# Altium schematic sheet Diagnostics.SchDoc: AI ARTIQ Driver
size 420 x 297 mm; Author: G.Kasprowicz; CompanyName: CTI; Organization: CTI; Address1: CTI; Address2: Nowowiejska 15/19 00-665 Warsaw; Address3: gkasprow@gmail.com; DocumentNumber: 6; Revision: 1.0; SheetNumber: 6; SheetTotal: 11; ModifiedBy: -; CheckedDate: -; Title2: protection; DivGrp: CTI; ModifiedDate: -; ProjectName: Sensor Box
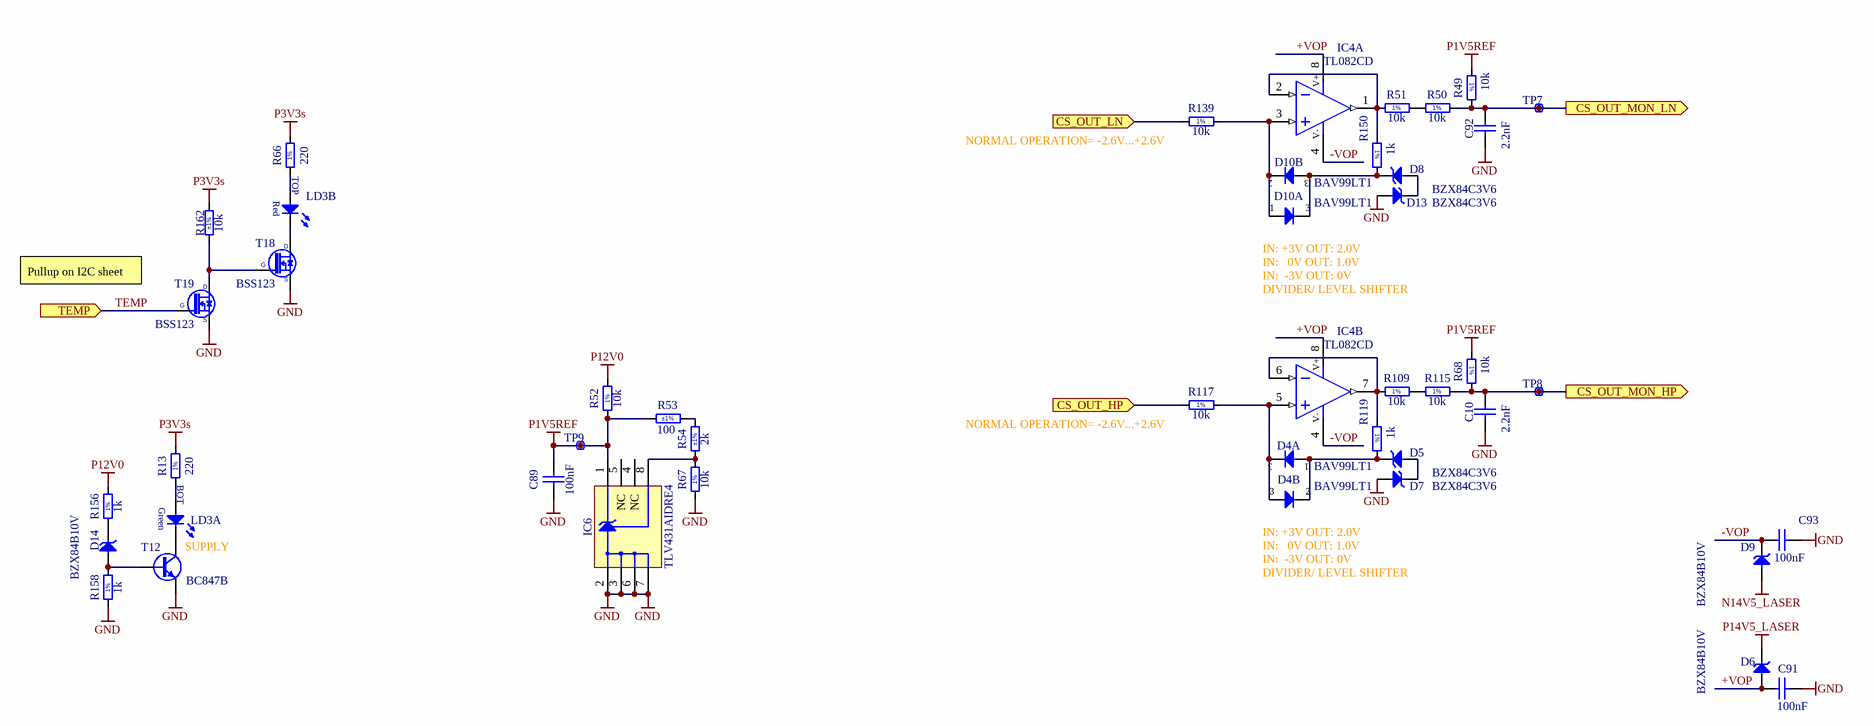
[diagram p0: Diagnostics.SchDoc]

## Parts
C10  2.2nF  [CAPC1608X87N]
C89  100nF  [CAPC1608X87N]
C91  100nF  [CAPC1608X87N]
C92  2.2nF  [CAPC1608X87N]
C93  100nF  [CAPC1608X87N]
D4  BAV99LT1  [SOT95P240X110-3N]  (parts A,B of 2)
D5  BZX84C3V6  [SOT95P240X130-3N]
D6  BZX84B10V  [SOT95P248X115-3N]
D7  BZX84C3V6  [SOT95P240X130-3N]
D8  BZX84C3V6  [SOT95P240X130-3N]
D9  BZX84B10V  [SOT95P248X115-3N]
D10  BAV99LT1  [SOT95P240X110-3N]  (parts A,B of 2)
D13  BZX84C3V6  [SOT95P240X130-3N]
D14  BZX84B10V  [SOT95P248X115-3N]
IC4  TL082CD  [SOIC127P600X175-8N]  (parts A,B of 2)
IC6  TLV431AIDRE4  [SOIC127P600X175-8N]
LD3  Red/Green  [LED_DIALIGHT_571-0112F]  (value not drawn)  (parts A,B of 2)
R13  220  [RESC1608X55N]
R49  10k  [RESC1608X55N]
R50  10k  [RESC1608X55N]
R51  10k  [RESC1608X55N]
R52  10k  [RESC1608X55N]
R53  100  Tolerance: ±1%  [RESC1608X55N]
R54  2k  Tolerance: ±1%  [RESC1608X55N]
R66  220  [RESC1608X55N]
R67  10k  [RESC1608X55N]
R68  10k  [RESC1608X55N]
R109  10k  [RESC1608X55N]
R115  10k  [RESC1608X55N]
R117  10k  [RESC1608X55N]
R119  1k  [RESC1608X55N]
R139  10k  [RESC1608X55N]
R150  1k  [RESC1608X55N]
R156  1k  [RESC1608X55N]
R158  1k  [RESC1608X55N]
R162  10k  Tolerance: ±1%  [RESC1005X40N]
T12  BC847B  [SOT95P230X110-3N]
T18  BSS123  [SOT95P240X130-3N]
T19  BSS123  [SOT95P240X130-3N]
TP7  Test Point  [TPS127]  (value not drawn)  (no BOM)
TP8  Test Point  [TPS127]  (value not drawn)  (no BOM)
TP9  Test Point  [TPS127]  (value not drawn)  (no BOM)

## Ports
CS_OUT_HP (in), CS_OUT_LN (in), CS_OUT_MON_HP (out), CS_OUT_MON_LN (out), TEMP (in)

## Nets
GND: C10.1 C89.1 C91.2 C92.1 C93.2 D7.1(A) D13.1(A) IC6.2(A) IC6.3(A) IC6.6(A) IC6.7(A) R67.1 R158.1 T12.2(E) T18.2(S) T19.2(S)
N14V5_LASER: D9.1(A)
P1V5REF: C89.2 IC6.1(C) R49.1 R52.1 R53.2 R68.1 TP9.1
P3V3s: R13.2 R66.2 R162.2
P12V0: R52.2 R156.2
P14V5_LASER: D6.3(C)
+VOP: C91.1 D6.1(A) IC4.8(V+)
-VOP: C93.1 D9.3(C) IC4.4(V-)
CS_OUT_HP: R117.1 ; port CS_OUT_HP
CS_OUT_LN: R139.1 ; port CS_OUT_LN
CS_OUT_MON_HP: C10.2 R68.2 R115.2 TP8.1 ; port CS_OUT_MON_HP
CS_OUT_MON_LN: C92.2 R49.2 R50.2 TP7.1 ; port CS_OUT_MON_LN
TEMP: T19.1(G) ; port TEMP
NetD4_1: D4.1(A) D4.2(C) D5.3(C) R119.2
NetD4_3: D4.3(COMAC) IC4.5(IN+) R117.2
NetD5_1: D5.1(A) D7.3(C)
NetD8_1: D8.1(A) D13.3(C)
NetD8_3: D8.3(C) D10.3(COMAC) R150.2
NetD10_1: D10.1(A) D10.2(C) IC4.3(IN+) R139.2
NetD14_1: D14.1(A) R158.2 T12.1(B)
NetD14_3: D14.3(C) R156.1
NetIC4_1: IC4.1(OUT) IC4.2(IN-) R51.1 R150.1
NetIC4_6: IC4.6(IN-) IC4.7(OUT) R109.1 R119.1
NetIC6_8: IC6.8(REF) R54.1 R67.2
NetLD3_1: LD3.1(C) T12.3(C)
NetLD3_2: LD3.2(A) R13.1
NetLD3_3: LD3.3(C) T18.3(D)
NetLD3_4: LD3.4(A) R66.1
NetR50_1: R50.1 R51.2
NetR53_1: R53.1 R54.2
NetR109_2: R109.2 R115.1
NetR162_1: R162.1 T18.1(G) T19.3(D)

Not connected (* = marked no-connect by the designer): IC6 4(NC) 5(NC)

## Notes on the sheet
- (near R139) NORMAL OPERATION= -2.6V...+2.6V
- Pullup on I2C sheet
- IN:  -3V OUT: 0V
- (near D10) IN: +3V OUT: 2.0V
- IN:   0V OUT: 1.0V
- DIVIDER/ LEVEL SHIFTER
- (near R117) NORMAL OPERATION= -2.6V...+2.6V
- SUPPLY
- (near D4) IN: +3V OUT: 2.0V
- Project/Equipment
- Document
- Designer
- Drawn by
- Check.by
- Copyright 2018.
  This documentation describes Open Hardware and is licensed under the CERN OHL v.1.1. You may redistribute and modify this documentation under the terms of the CERN OHL v.1.1. (http://ohwr.org/CERNOHL). This documentation is distributed WITHOUT ANY EXPRESS OR IMPLIED WARRANTY, INCLUDING OF MERCHANTABILITY, SATISFACTORY QUALITY AND FITNESS FOR A PARTICULAR PURPOSE. Please see the CERN OHL v.1.1 for applicable conditions.
- Contact
- File
- Last Mod.
- Print Date
- Sheet
- Size
- A3
- of
- Rev
- (in symbol LED_DIALIGHT_571-0112F, part A) BOT; Green
- (in symbol LED_DIALIGHT_571-0112F, part B) TOP; Red
- (in symbol R0603_1K_1%_0.1W_100PPM) 1%
- (in symbol R0603_10K_1%_0.1W_100PPM) 1%
- (in symbol R0603_220R_1%_0.1W_100PPM) 1%

## Library data of the parts
C10 C92 = CC0603_2.2NF_50V_5%_C0G: Non-polarised capacitor; Part Description: SMD Multilayer Chip Ceramic Capacitor; Manufacturer: GENERIC; Manufacturer1 Part Number: C1608C0G1H222J080AA; Voltage: 50V; TC: C0G/NP0; Tolerance: ±5%; Part Number: CC0603_2.2NF_50V_5%_C0G; Component Kind: Standard; Component Type: Standard; Pin Count: 2; Value: 2.2nF; Status: Preferred; Manufacturer Part Number: CC0603_2.2NF_50V_5%_C0G; Case: 0603; Mounted: Yes; Socket: No; SMD: Yes; Sense: No; Manufacturer1 Example: TDK; Manufacturer1 ComponentHeight: 0.9mm; HelpURL: \\cern.ch\dfs\Applications\Altium\Datasheets\CC0603_C0G_TDK_C.pdf; Author: CERN DEM JMW; CreateDate: 23.06.2014; LatestRevisionDate: 23.06.2014
C89 C91 C93 = CC0603_100NF_50V_10%_X7R: Non-polarised capacitor; Part Description: SMD Multilayer Chip Ceramic Capacitor; Manufacturer: GENERIC; Manufacturer1 Part Number: 223858615649; Voltage: 50V; TC: X7R; Tolerance: ±10%; Part Number: CC0603_100NF_50V_10%_X7R; Component Kind: Standard; Component Type: Standard; Pin Count: 2; Value: 100nF; Status: Preferred; Manufacturer Part Number: CC0603_100NF_50V_10%_X7R; Case: 0603; Mounted: Yes; Socket: No; SMD: Yes; Sense: No; Manufacturer1 Example: PHYCOMP; Manufacturer1 ComponentHeight: 0.87mm; HelpURL: \\cern.ch\dfs\Applications\Altium\Datasheets\CC0603_X7R_PHYCOMP.pdf; Author: CERN DEM JLC; CreateDate: 03.12.2007; LatestRevisionDate: 03.12.2007
D4 D10 = BAV99LT1: Serial Diode; Part Description: Dual Series Switching Diode; Manufacturer: ON SEMICONDUCTOR; Voltage: 70V; Power: 225mW; PressFit: No; Bonding: No; Part Number: BAV99LT1; Component Kind: Standard; Component Type: Standard; Device: BAV99LT1; PackageDescription: SOT, 0.95mm Pitch; 3 Pin, 1.40mm W X 3.00mm L X 1.10mm H body, IPC Medium Density; Status: Obsolete; Manufacturer Part Number: BAV99LT1; Pin Count: 3; Case: SOT23-3; Mounted: Yes; Socket: No; SMD: Yes; Sense: No; ComponentHeight: 1.11mm; HelpURL: \\cern.ch\dfs\Applications\Altium\Datasheets\BAV99LT1.pdf; Author: CERN DEM JLC; CreateDate: 12.02.2009; LatestRevisionDate: 12.02.2009
D5 D7 D8 D13 = BZX84C3V6: Diode Zener Anode Pin 1 Cathode Pin 3 (Pas de pin 2); Part Description: Zener Diode; Manufacturer: FAIRCHILD SEMICONDUCTOR; Voltage: 3V6; Power: 350mW; PressFit: No; Bonding: No; Part Number: BZX84C3V6; Component Kind: Standard; Component Type: Standard; Device: BZX84C3V6; PackageDescription: SOT, 0.95mm Pitch; 3 Pin, 1.30mm W X 2.90mm L X 1.30mm H body, IPC Medium Density; Manufacturer Part Number: BZX84C3V6; Pin Count: 3; Case: SOT23-3; Mounted: Yes; Socket: No; SMD: Yes; Sense: No; ComponentHeight: 1.3mm; HelpURL: \\cern.ch\dfs\Applications\Altium\Datasheets\BZX84C3V6.pdf; Author: CERN DEM JLC; CreateDate: 06.10.2016; LatestRevisionDate: 06.10.2016
D6 D9 D14 = BZX84B10V: Diode Zener Anode Pin 1 Cathode Pin 3 (Pas de pin 2); Part Description: Small Signal Zener Diode; Manufacturer: VISHAY SEMICONDUCTORS; Voltage: 10V; Power: 300mW; PressFit: No; Bonding: No; Part Number: BZX84B10V; Component Kind: Standard; Component Type: Standard; Device: BZX84B10V; PackageDescription: SOT, 0.95mm Pitch; 3 Pin, 1.315mm W X 2.95mm L X 1.15mm H body, IPC Medium Density; Manufacturer Part Number: BZX84B10V; Pin Count: 2; Case: SOT23-3; Mounted: Yes; Socket: No; SMD: Yes; Sense: No; ComponentHeight: 1.15mm; HelpURL: \\cern.ch\dfs\Applications\Altium\Datasheets\BZX84B10V.pdf; Author: CERN DEM JLC; CreateDate: 23.10.2013; LatestRevisionDate: 23.10.2013
IC4 = TL082CD: Dual Operational Amplifier; Part Description: Dual JFET-Input Operational Amplifier; Manufacturer: TEXAS INSTRUMENTS; PressFit: No; Bonding: No; Part Number: TL082CD; Component Kind: Standard; Component Type: Standard; Device: TL082CD; PackageDescription: SOIC 8, Pitch 1.27mm - Body 4x5mm, IPC Medium Density; Manufacturer Part Number: TL082CD; Pin Count: 8; Case: SOIC8; Mounted: Yes; Socket: No; SMD: Yes; Sense: No; ComponentHeight: 1.75mm; Author: CERN DEM JLC; HelpURL: \\cern.ch\dfs\Applications\Altium\Datasheets\TL082CD.pdf; CreateDate: 20.05.2010; LatestRevisionDate: 20.05.2010
IC6 = TL431CD: Precision Programmable Reference; Part Description: Vref (1.25V) To 36V 2% Precision Programmable Reference; Manufacturer: TEXAS INSTRUMENTS; PressFit: No; Bonding: No; Part Number: TLV431AIDRE4; Component Kind: Standard; Component Type: Standard; Device: TLV431AIDRE4; PackageDescription: SOIC 8, Pitch 1.27mm, Body 4x5mm, IPC Medium Density; Manufacturer Part Number: TLV431AIDRE4; Pin Count: 8; Case: SOIC8; Mounted: Yes; Socket: No; SMD: Yes; Sense: No; ComponentHeight: 1.75mm; HelpURL: \\cern.ch\dfs\Applications\Altium\Datasheets\TL431CD.pdf; Author: CERN DEM JLC; CreateDate: 18.01.2011; LatestRevisionDate: 28.02.2011
LD3 = LED_DIALIGHT_571-0112F: 2x LED  Botom Green, Top Red; Part Description: Dual 2mm  LEDs, Red Top,Green Bot, CBI® Circuit Board Indicator (Without positioning pins); PressFit: No; Bonding: No; Part Number: LED_DIALIGHT_571-0112F; Component Kind: Standard; Component Type: Standard; Color: Red/Green; PackageDescription: 2x 2mm LED (Top: Red, Bot: Green) PCB Edge Mounting (Without positioning pins) DIALIGHT 571 Serie; Manufacturer: DIALIGHT; Manufacturer Part Number: 571-0112F; Pin Count: 4; Mounted: Yes; Socket: No; SMD: No; Sense: No; ComponentHeight: 8.6mm; HelpURL: \\cern.ch\dfs\Applications\Altium\Datasheets\LED_DIALIGHT_571-0112F.pdf; Author: CERN DEM JLC; CreateDate: 09/11/2009; LatestRevisionDate: 17/03/2010
R13 R66 = R0603_220R_1%_0.1W_100PPM: Resistor - 1%; Part Description: General Purpose Thick Film Chip Resistor; Manufacturer: GENERIC; Manufacturer1 Part Number: NRC06F2200TRF; Power: 0.1W; TC: ±100ppm/°C; Part Number: R0603_220R_1%_0.1W_100PPM; Component Kind: Standard; Component Type: Standard; Pin Count: 2; Value: 220; Status: Preferred; Tolerance: ±1%; Manufacturer Part Number: R0603_220R_1%_0.1W_100PPM; Case: 0603; Mounted: Yes; Sense: No; Socket: No; SMD: Yes; Manufacturer1 Example: NIC COMPONENT; Manufacturer1 ComponentHeight: 0.55mm; HelpURL: \\cern.ch\dfs\Applications\Altium\Datasheets\R0603_NIC_NRC.pdf; Author: CERN DEM JLC; CreateDate: 03.12.2007; LatestRevisionDate: 13.03.2008
R49-R52 R67 R68 R109 R115 R117 R139 = R0603_10K_1%_0.1W_100PPM: Resistor - 1%; Part Description: General Purpose Thick Film Chip Resistor; Manufacturer: GENERIC; Manufacturer1 Part Number: NRC06F1002TRF; Power: 0.1W; TC: ±100ppm/°C; PressFit: No; Part Number: R0603_10K_1%_0.1W_100PPM; Component Kind: Standard; Component Type: Standard; Pin Count: 2; Value: 10k; Status: Preferred; Tolerance: ±1%; Manufacturer Part Number: R0603_10K_1%_0.1W_100PPM; Case: 0603; Mounted: Yes; Sense: No; Socket: No; SMD: Yes; Manufacturer1 Example: NIC COMPONENT; Manufacturer1 ComponentHeight: 0.55mm; HelpURL: \\cern.ch\dfs\Applications\Altium\Datasheets\R0603_NIC_NRC.pdf; Author: CERN DEM JLC; CreateDate: 03.12.2007; LatestRevisionDate: 13.03.2008
R53 = R0603_100R_1%_0.1W_100PPM: Resistor - 1%; Part Description: General Purpose Thick Film Chip Resistor; Manufacturer: GENERIC; Manufacturer1 Part Number: NRC06F4700TRF; Power: 0.1W; TC: ±100ppm/°C; PressFit: No; Part Number: R0603_100R_1%_0.1W_100PPM; Component Kind: Standard; Component Type: Standard; Pin Count: 2; Value: 100; Status: Preferred; Manufacturer Part Number: R0603_100R_1%_0.1W_100PPM; Case: 0603; Mounted: Yes; Sense: No; Socket: No; SMD: Yes; Manufacturer1 Example: NIC COMPONENT; Manufacturer1 ComponentHeight: 0.55mm; HelpURL: \\cern.ch\dfs\Applications\Altium\Datasheets\R0603_NIC_NRC.pdf; Author: CERN DEM JLC; CreateDate: 03.12.2007; LatestRevisionDate: 13.03.2008
R54 = R0603_2K_1%_0.1W_100PPM: Resistor - 1%; Part Description: General Purpose Thick Film Chip Resistor; Manufacturer: GENERIC; Manufacturer1 Part Number: NRC06F2001TRF; Power: 0.1W; TC: ±100ppm/°C; PressFit: No; Part Number: R0603_2K_1%_0.1W_100PPM; Component Kind: Standard; Component Type: Standard; Pin Count: 2; Value: 2k; Status: Preferred; Manufacturer Part Number: R0603_2K_1%_0.1W_100PPM; Case: 0603; Mounted: Yes; Sense: No; Socket: No; SMD: Yes; Manufacturer1 Example: NIC COMPONENT; Manufacturer1 ComponentHeight: 0.55mm; HelpURL: \\cern.ch\dfs\Applications\Altium\Datasheets\R0603_NIC_NRC.pdf; Author: CERN DEM JLC; CreateDate: 03.12.2007; LatestRevisionDate: 13.03.2008
R119 R150 R156 R158 = R0603_1K_1%_0.1W_100PPM: Resistor - 1%; Part Description: General Purpose Thick Film Chip Resistor; Manufacturer: GENERIC; Manufacturer1 Part Number: NRC06F1001TRF; Power: 0.1W; TC: ±100ppm/°C; PressFit: No; Part Number: R0603_1K_1%_0.1W_100PPM; Component Kind: Standard; Component Type: Standard; Pin Count: 2; Value: 1k; Status: Preferred; Tolerance: ±1%; Manufacturer Part Number: R0603_1K_1%_0.1W_100PPM; Case: 0603; Mounted: Yes; Sense: No; Socket: No; SMD: Yes; Manufacturer1 Example: NIC COMPONENT; Manufacturer1 ComponentHeight: 0.55mm; HelpURL: \\cern.ch\dfs\Applications\Altium\Datasheets\R0603_NIC_NRC.pdf; Author: CERN DEM JLC; CreateDate: 03.12.2007; LatestRevisionDate: 13.03.2008
R162 = R0402_10K_1%_0.0625W_100PPM: Resistor - 1%; Part Description: General Purpose Thick Film Chip Resistor; Manufacturer: GENERIC; Manufacturer1 Part Number: 232270671003L; TC: ±100ppm/°C; PressFit: No; Part Number: R0402_10K_1%_0.0625W_100PPM; Component Kind: Standard; Component Type: Standard; Pin Count: 2; Value: 10k; Status: Not Recommended; Power: 0.0625W; Manufacturer Part Number: R0402_10K_1%_0.0625W_100PPM; Case: 0402; Mounted: Yes; Sense: No; Socket: No; SMD: Yes; Manufacturer1 Example: YAGEO PHYCOMP; Manufacturer1 ComponentHeight: 0.4mm; HelpURL: \\cern.ch\dfs\Applications\Altium\Datasheets\R0402_Phycomp_RC0402.pdf; Author: CERN DEM JLC; CreateDate: 03.12.2007; LatestRevisionDate: 17.10.2012
T12 = BC847B: NPN Transistor; Part Description: 45V 100mA NPN general-purpose transistors; Manufacturer: NXP SEMICONDUCTORS; PressFit: No; Bonding: No; Part Number: BC847B; Component Kind: Standard; Component Type: Standard; Device: BC847B; PackageDescription: SOT23, 0.95mm Pitch; 3 Pin, 1.30mm W X 2.90mm L X 1.10mm H body, IPC Medium Density; Manufacturer Part Number: BC847B; Pin Count: 3; Case: SOT23-3; Mounted: Yes; Socket: No; SMD: Yes; Sense: No; ComponentHeight: 1.1mm; HelpURL: \\cern.ch\dfs\Applications\Altium\Datasheets\BC847B.pdf; Author: CERN DEM JLC; CreateDate: 14.06.2011; LatestRevisionDate: 14.06.2011
T18 T19 = BSS123: N-CHANNEL MOSFET WITH DIODE; Part Description: 100V 170mA N-Channel Logic Level Enhancement Mode Field Effect Transistor (FET); Manufacturer: FAIRCHILD SEMICONDUCTOR; PressFit: No; Bonding: No; Part Number: BSS123; Component Kind: Standard; Component Type: Standard; Device: BSS123; PackageDescription: SOT23, 0.95mm Pitch; 3 Pin, 1.30mm W X 2.90mm L X 1.30mm H body, IPC Medium Density; Manufacturer Part Number: BSS123; Pin Count: 3; Case: SOT23-3; Mounted: Yes; Socket: No; SMD: Yes; Sense: No; ComponentHeight: 1.3mm; HelpURL: \\cern.ch\dfs\Applications\Altium\Datasheets\BSS123.pdf; Author: CERN DEM JLC; CreateDate: 07.04.2009; LatestRevisionDate: 07.04.2009
TP7-TP9 = SMD_PAD_1.27X1.27MM: Part Description: 1.27mm x 1.27mm PCB Copper Area (SMD Test Point); Mounted: No; Part Number: SMD_PAD_1.27X1.27MM; Component Type: Standard (No BOM); Pin Count: 1; Family: Test Point; Socket: No; SMD: No; Sense: No; Status: None; ComponentHeight: 0mm; HelpURL: Undefined; Author: CERN DEM JLC; CreateDate: 12.01.2008; LatestRevisionDate: 12.01.2008; PackageDescription: 1.27mm x 1.27mm PCB Copper Area (SMD Test Point)